# EAGLE design MOSFET_PowerControlKit (EAGLE 6.4)
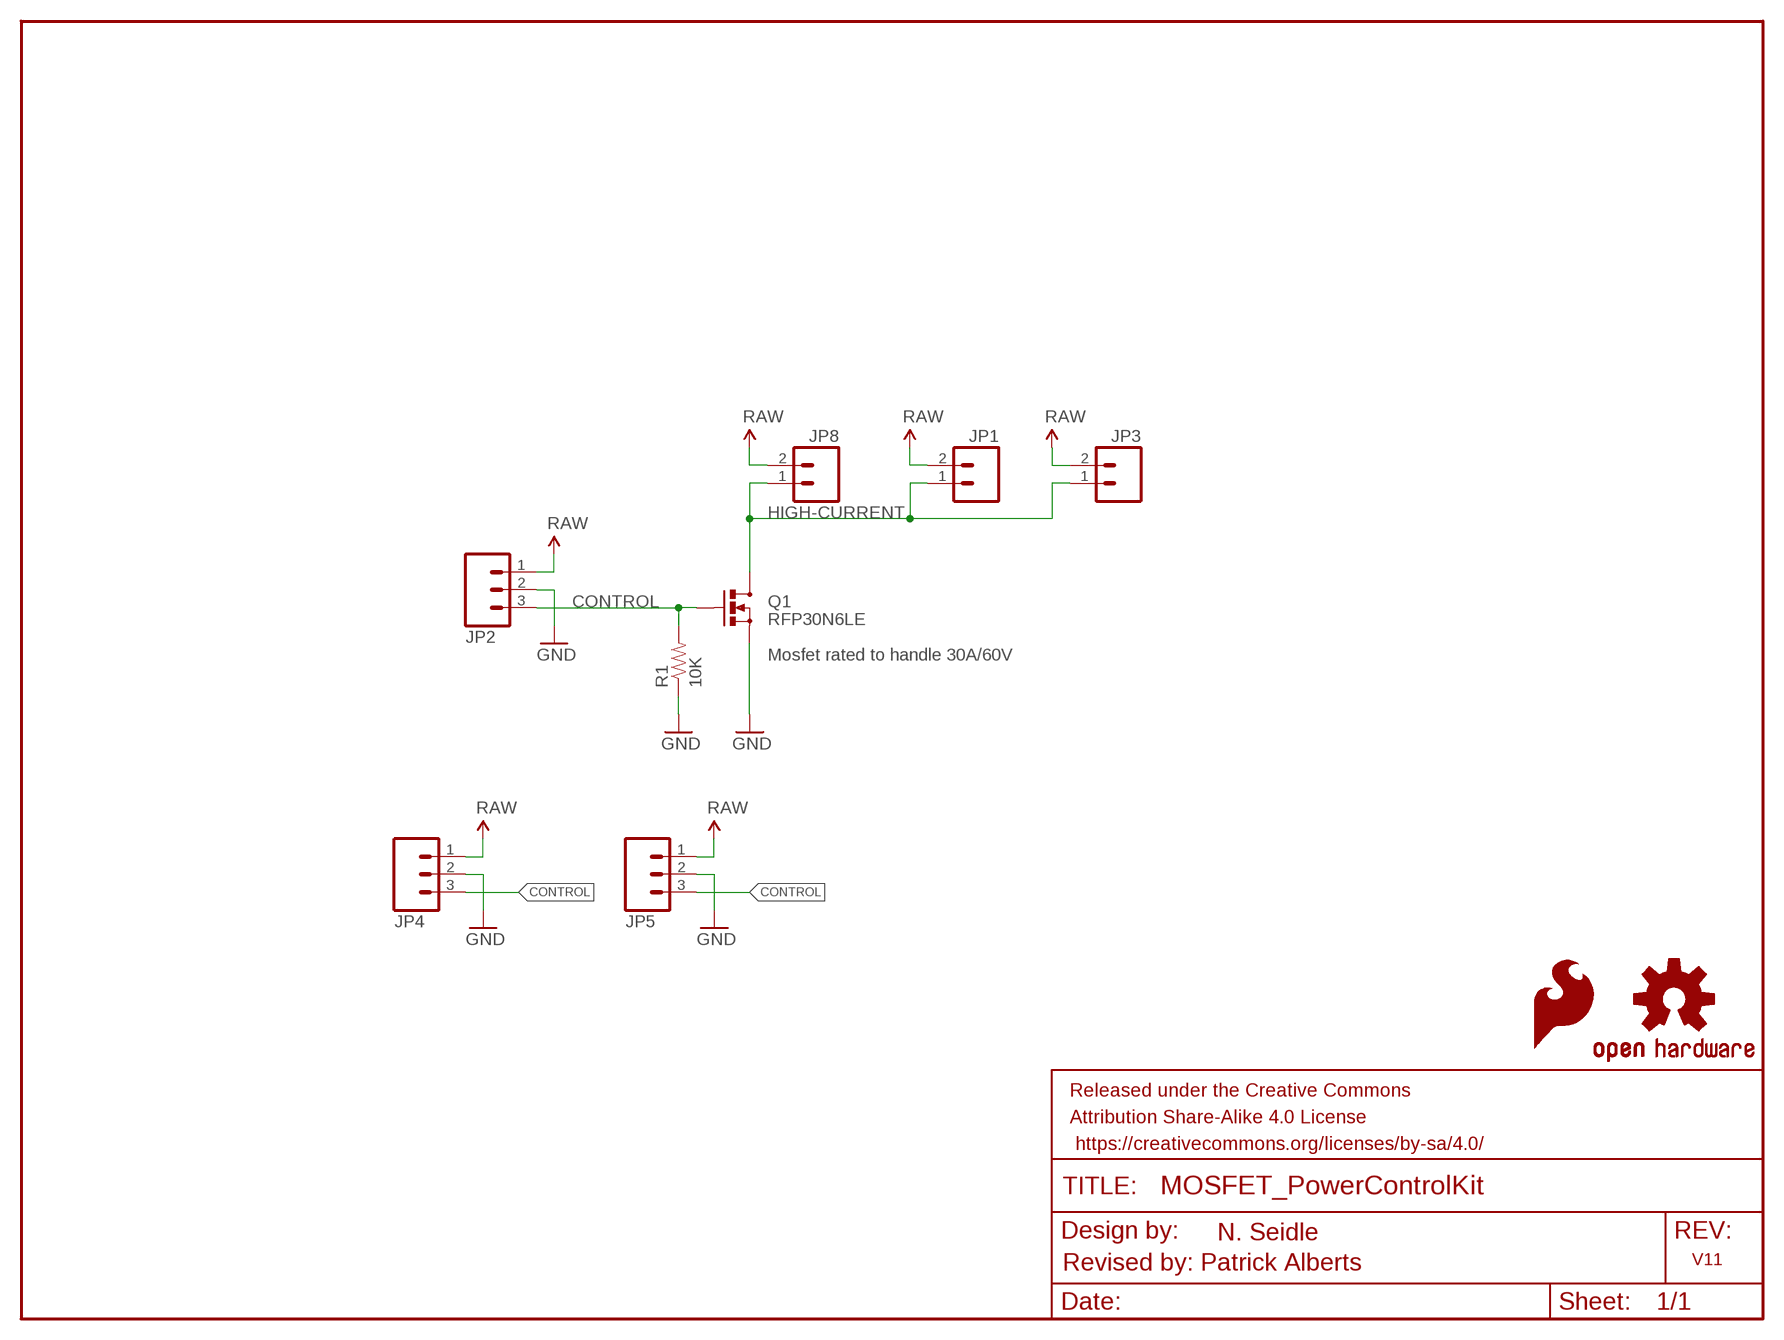
[diagram p0: schematic, sheet 1]

## Parts
FRAME1  FRAME-LETTER  [CREATIVE_COMMONS]
JP1  M023.5MM  [SCREWTERMINAL-3.5MM-2]
JP2  M03JST-PTH  [JST-3-PTH]
JP3  M02PTH  [1X02]
JP4  M03SCREW  [SCREWTERMINAL-3.5MM-3]
JP5  M03PTH  [1X03]
JP8  M02JST-PTH-2  [JST-2-PTH]
LOGO1  OSHW-LOGOS  [OSHW-LOGO-S]
LOGO2  SFE_LOGO_FLAME.1_INCH  [SFE_LOGO_FLAME_.1]
Q1  RFP30N6LE  MOSFET-NCHANNELPTH2  [TO220V]
R1  10K  RESISTORPTH1  [AXIAL-0.3]

## Nets
CONTROL: JP2.3 JP4.3 JP5.3 Q1.1(G) R1.P$2
GND: JP2.2 JP4.2 JP5.2 Q1.3(S) R1.P$1
HIGH-CURRENT: JP1.1 JP3.1 JP8.1 Q1.2(D)
VCC: JP1.2 JP2.1 JP3.2 JP4.1 JP5.1 JP8.2 ; supply symbol labelled RAW

## Notes on the sheet
- Mosfet rated to handle 30A/60V
- N. Seidle
- V11
- Revised by: Patrick Alberts

## Library data of the parts
FRAME1 = SparkFun-Aesthetics:FRAME-LETTER: Schematic Frame Standard 8.5x11 US Letter frame
JP1 JP8 = SparkFun:M02: Header 2 Standard 2-pin 0.1" header. Use with straight break away headers (SKU : PRT-00116), right angle break away headers (PRT-00553), swiss pins (PRT-00743), machine pins (PRT-00117), and female headers (PRT-00115). Molex polarized connector foot print use with SKU : PRT-08233 with associated crimp pins and housings.
JP2 JP4 JP5 = SparkFun:M03: Header 3 Standard 3-pin 0.1" header. Use with straight break away headers (SKU : PRT-00116), right angle break away headers (PRT-00553), swiss pins (PRT-00743), machine pins (PRT-00117), and female headers (PRT-00115). Molex polarized connector foot print use with SKU : PRT-08232 with associated crimp pins and housings.
JP3 = SparkFun-Connectors:M02: Standard 2-pin 0.1" header. Use with - straight break away headers ( PRT-00116) - right angle break away headers (PRT-00553) - swiss pins (PRT-00743) - machine pins (PRT-00117) - female headers (PRT-00115) Molex polarized connector foot print use with: PRT-08233 with associated crimp pins and housings. 2.54_SCREWTERM for use with PRT-10571. 3.5mm Screw Terminal footprints for PRT-08084 5mm Screw Terminal footprints for use with PRT-08433
LOGO1 = SparkFun-Aesthetics:OSHW-LOGO: Open Source Hardware Logo This logo indicates the piece of hardware it is found on incorporates a OSHW license and/or adheres to the definition of open source hardware found here: http://freedomdefined.org/OSHW
LOGO2 = SparkFun-Aesthetics:SFE_LOGO_FLAME: SFE Logo, flame only This is the SparkFun flame logo. The logo on the schematic will always be the same size; the package variant is the height of the flame. Default layer for the logo on the board is tSilk.
Q1 = SparkFun:MOSFET-NCHANNEL
R1 = SparkFun:RESISTOR: Resistor Basic schematic elements and footprints for 0603, 1206, and PTH 1/10th watt (small) resistors.

## Board
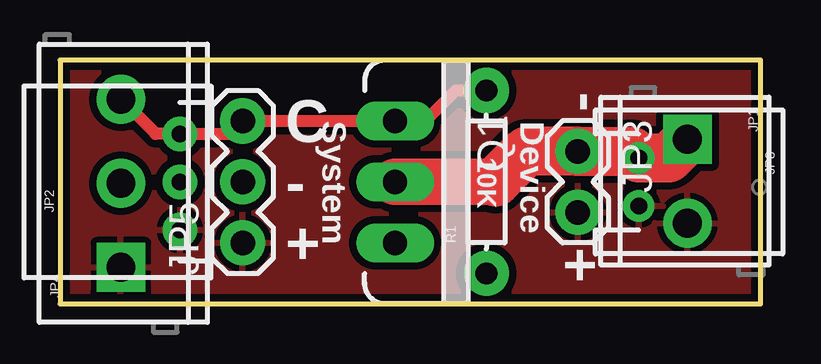
[diagram p1: board, top side]
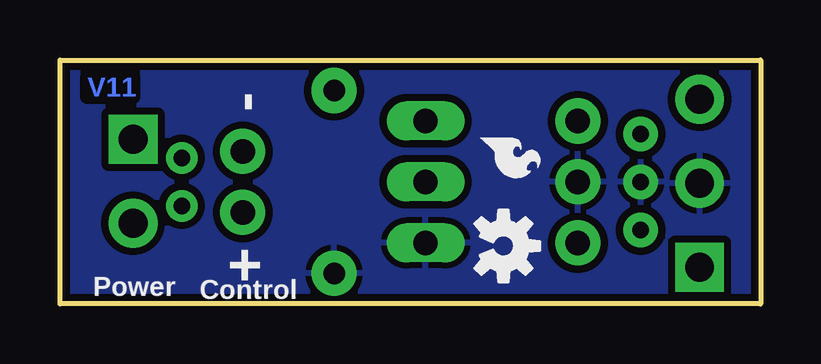
[diagram p2: board, bottom side, seen from below]

Size 29.21 x 10.16 mm. Coordinates in mm from the lower left corner, seen from the top.
Outline: 0,0 29.21,0 29.21,10.16 0,10.16 0,0
Copper layers (1*16): Top 0.035mm / dielectric 1.5mm / Bottom 0.035mm
Design rules "SparkFun-2-layer": minimum track width 7mil, minimum drill 15mil, track to track 8mil, track to pad 8mil, pad to pad 8mil, via to via 8mil, smd to smd 8mil, copper to edge 8mil, drill to drill 8mil, minimum pad ring 12mil, minimum via ring 10mil, stop-mask expansion 4mil, vias tented up to drill 20mil, thermal gap 10mil

### Footprints (pad centres in the part's own frame; a part is rotated, then mirrored left to right if it is on the bottom)
SCREWTERMINAL-3.5MM-2 = drill 1.2 pad 2.032 square: 1 0,0 | drill 1.2 pad 2.032: 2 3.5,0
JST-3-PTH = drill 0.7 pad 1.448: 1 -2,-5; 2 0,-5; 3 2,-5
1X02 = drill 1.016 pad 1.88: 1 0,0; 2 2.54,0
SCREWTERMINAL-3.5MM-3 = drill 1.2 pad 2.032 square: 1 0,0 | drill 1.2 pad 2.032: 2 3.5,0; 3 7,0
1X03 = drill 1.016 pad 1.88: 1 0,0; 2 2.54,0; 3 5.08,0
JST-2-PTH = drill 0.7: 1 -1,0; 2 1,0
TO220V = drill 1.016 long: 1 -2.54,0; 2 0,0; 3 2.54,0
AXIAL-0.3 = drill 0.9 pad 1.88: P$1 -3.81,0; P$2 3.81,0

### Placement (x,y rotation side)
FRAME1  -9.37,-16.51 0 top  (outside the outline)
JP1  26.16,6.86 270 top
JP2  0,5.08 90 top
JP3  21.59,6.35 270 top
JP4  2.54,1.52 90 top
JP5  7.62,2.54 90 top
JP8  24.13,5.08 270 top
LOGO1  10.72,2.41 270 bottom
LOGO2  12.07,7.24 270 bottom
Q1  13.97,5.08 270 top
R1  17.78,5.08 90 top

### Tracks (layer width: path | path; a pad name or v marks a point on that pad's centre or on a via)
CONTROL
  Top 0.508: R1.P$2 16.51,8.89 15.24,7.62 Q1.1 JP5.3 7.08,7.08 JP2.3 3.98,7.08 JP4.3
GND
  pour Bottom (isolate 0.305): 0,10.16 29.21,10.16 29.21,0 0,0
HIGH-CURRENT
  Top 1.93: 18.16,5.08 Q1.2
  Top 2.032: JP1.1 25.38,6.08 JP8.1 23.86,6.35 JP3.1 21.56,6.38 19.46,6.38 18.16,5.08
VCC
  pour Top (isolate 0.305): 0,10.16 29.21,10.16 29.21,0 0,0

### Text on the board
Bottom: V11
tPlace: System | Device | - | C | - | + | +
bPlace: - | Control | + | + | Power
tDocu: N. Seidle | Revised by: P. Alberts